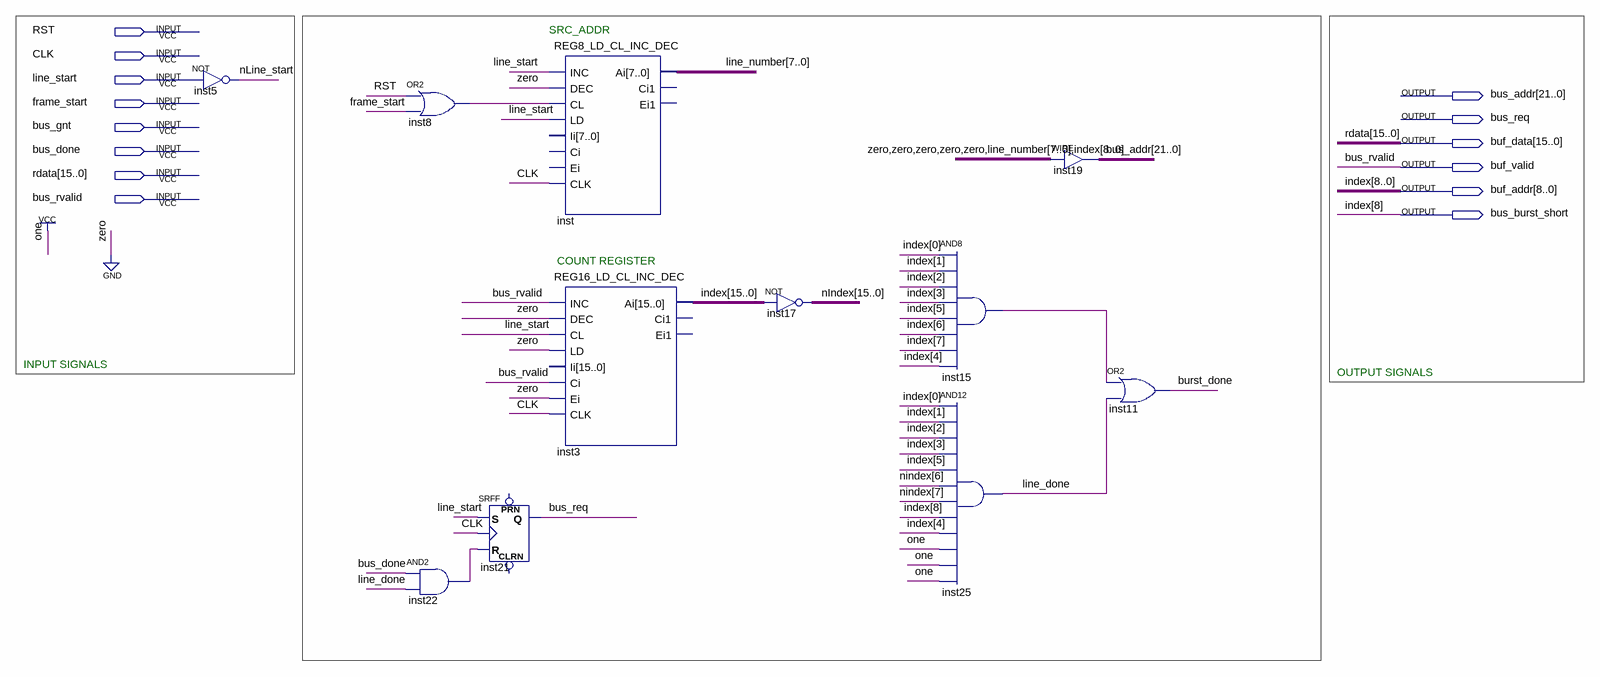
[diagram p0: schematic sheet]
// Quartus schematic scanoutDMA.bdf as structural Verilog: 11 symbols, 14 pins
module scanoutDMA (
  input  RST,
  input  CLK,
  input  line_start,
  input  frame_start,
  input  bus_gnt,
  input  bus_done,
  input  [15:0] rdata,
  input  bus_rvalid,
  output [21:0] bus_addr,
  output bus_req,
  output [15:0] buf_data,
  output buf_valid,
  output [8:0] buf_addr,
  output bus_burst_short
);

  wire burst_done, inst8_out, inst15_out, inst22_out, line_done, nLine_start;
  wire [7:0] line_number;
  wire [15:0] nIndex;
  wire [15:9] index;

  // NOT inst5 has open pins: IN=open, OUT=nLine_start
  or inst8 (inst8_out, RST, frame_start);
  and inst22 (inst22_out, bus_done, line_done);
  SRFF inst21 (.S(line_start), .R(inst22_out), .CLK(CLK), .Q(bus_req));  // open: PRN, CLRN
  REG8_LD_CL_INC_DEC inst (
    .INC(line_start), .DEC(1'b0), .CL(inst8_out), .LD(line_start), .CLK(CLK), .Ai(line_number));  // open: Ii, Ci, Ei, Ci1, Ei1
  REG16_LD_CL_INC_DEC inst3 (
    .INC(bus_rvalid), .DEC(1'b0), .CL(line_start), .LD(1'b0), .Ci(bus_rvalid), .Ei(1'b0), .CLK(CLK),
    .Ai({index, buf_addr}));  // open: Ii, Ci1, Ei1
  assign nIndex = ~{index, buf_addr};  // NOT inst17, 16 bits wide
  and inst15 (inst15_out, buf_addr[0], buf_addr[1], buf_addr[2], buf_addr[3], buf_addr[5], buf_addr[6], buf_addr[7], buf_addr[4]);
  and inst25 (line_done, buf_addr[0], buf_addr[1], buf_addr[2], buf_addr[3], buf_addr[5], nIndex[6], nIndex[7], buf_addr[8], buf_addr[4], 1'b1, 1'b1, 1'b1);
  assign bus_addr = {{5{1'b0}}, line_number, buf_addr};  // WIRE inst19
  or inst11 (burst_done, inst15_out, line_done);

  assign buf_data = rdata;
  assign buf_valid = bus_rvalid;
  assign bus_burst_short = buf_addr[8];

  // Other names for the same wires on the sheet: index[8:0] = buf_addr

  // Notes on the sheet:
  //   SRC_ADDR
  //   COUNT REGISTER
  //   INPUT SIGNALS
  //   OUTPUT SIGNALS
endmodule
